# Altium project EEar04.PrjPcb
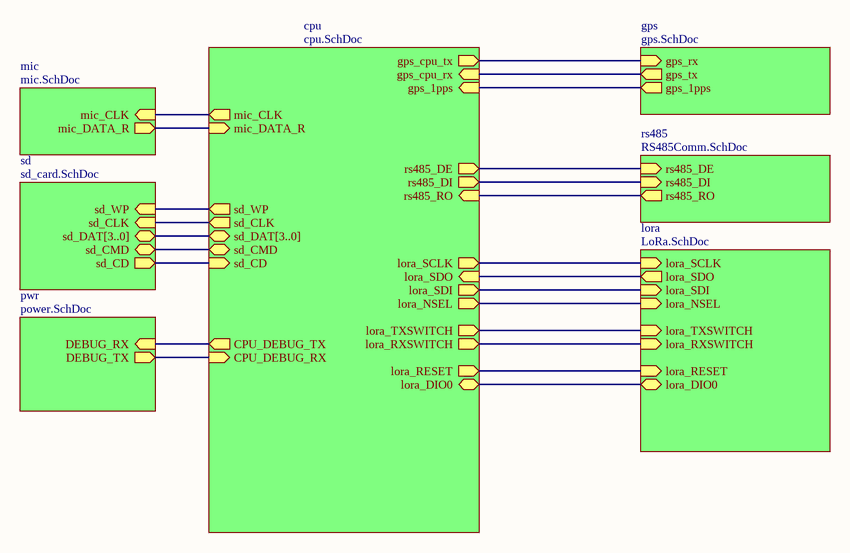
[diagram p0: top.SchDoc]
8 sheets, 130 parts. Net scope: hierarchical (ports join the sheet entries above them; power ports are global).
Board file: EEar04.PcbDoc
Sheets:
  top.SchDoc
    cpu = cpu.SchDoc
    gps = gps.SchDoc
    pwr = power.SchDoc
    mic = mic.SchDoc
    sd = sd_card.SchDoc
    rs485 = RS485Comm.SchDoc
    lora = LoRa.SchDoc

## Sheet top.SchDoc
size A

### Sub-sheets
cpu = cpu.SchDoc: gps_1pps (in), mic_CLK (out), mic_DATA_R (in), sd_WP (out), sd_CLK (out), sd_DAT[3..0] (bidir), sd_CMD (bidir), sd_CD (in), CPU_DEBUG_RX (in), CPU_DEBUG_TX (out), gps_cpu_tx (out), gps_cpu_rx (in), rs485_DI (out), rs485_RO (in), rs485_DE (out), lora_RXSWITCH (out), lora_SDI (out), lora_SCLK (out), lora_SDO (in), lora_NSEL (out), lora_RESET (out), lora_TXSWITCH (out), lora_DIO0 (bidir)
gps = gps.SchDoc: gps_rx (in), gps_tx (out), gps_1pps (out)
lora = LoRa.SchDoc: lora_SDO (out), lora_SCLK (in), lora_NSEL (in), lora_DIO0 (bidir), lora_SDI (in), lora_RESET (in), lora_RXSWITCH (in), lora_TXSWITCH (in)
mic = mic.SchDoc: mic_CLK (in), mic_DATA_R (out)
pwr = power.SchDoc: DEBUG_RX (in), DEBUG_TX (out)
rs485 = RS485Comm.SchDoc: rs485_DE (in), rs485_DI (in), rs485_RO (out)
sd = sd_card.SchDoc: sd_WP (in), sd_CD (out), sd_CMD (bidir), sd_CLK (in), sd_DAT[3..0] (bidir)

### Nets
debug_rx: sheet cpu/CPU_DEBUG_RX, sheet pwr/DEBUG_TX
debug_tx: sheet cpu/CPU_DEBUG_TX, sheet pwr/DEBUG_RX
gps_1pps: sheet cpu/gps_1pps, sheet gps/gps_1pps
gps_cpu_rx: sheet cpu/gps_cpu_rx, sheet gps/gps_tx
gps_cpu_tx: sheet cpu/gps_cpu_tx, sheet gps/gps_rx
lora_DIO0: sheet cpu/lora_DIO0, sheet lora/lora_DIO0
lora_NSEL: sheet cpu/lora_NSEL, sheet lora/lora_NSEL
lora_RESET: sheet cpu/lora_RESET, sheet lora/lora_RESET
lora_RXSWITCH: sheet cpu/lora_RXSWITCH, sheet lora/lora_RXSWITCH
lora_SCLK: sheet cpu/lora_SCLK, sheet lora/lora_SCLK
lora_SDI: sheet cpu/lora_SDI, sheet lora/lora_SDI
lora_SDO: sheet cpu/lora_SDO, sheet lora/lora_SDO
lora_TXSWITCH: sheet cpu/lora_TXSWITCH, sheet lora/lora_TXSWITCH
mic_CLK: sheet cpu/mic_CLK, sheet mic/mic_CLK
mic_DATA_R: sheet cpu/mic_DATA_R, sheet mic/mic_DATA_R
rs485_DE: sheet cpu/rs485_DE, sheet rs485/rs485_DE
rs485_DI: sheet cpu/rs485_DI, sheet rs485/rs485_DI
rs485_RO: sheet cpu/rs485_RO, sheet rs485/rs485_RO
sd_CD: sheet cpu/sd_CD, sheet sd/sd_CD
sd_CLK: sheet cpu/sd_CLK, sheet sd/sd_CLK
sd_CMD: sheet cpu/sd_CMD, sheet sd/sd_CMD
sd_WP: sheet cpu/sd_WP, sheet sd/sd_WP

### Buses and harness runs
bus sheet cpu/sd_DAT[3..0] = sheet sd/sd_DAT[3..0]

## Sheet cpu.SchDoc
size A3
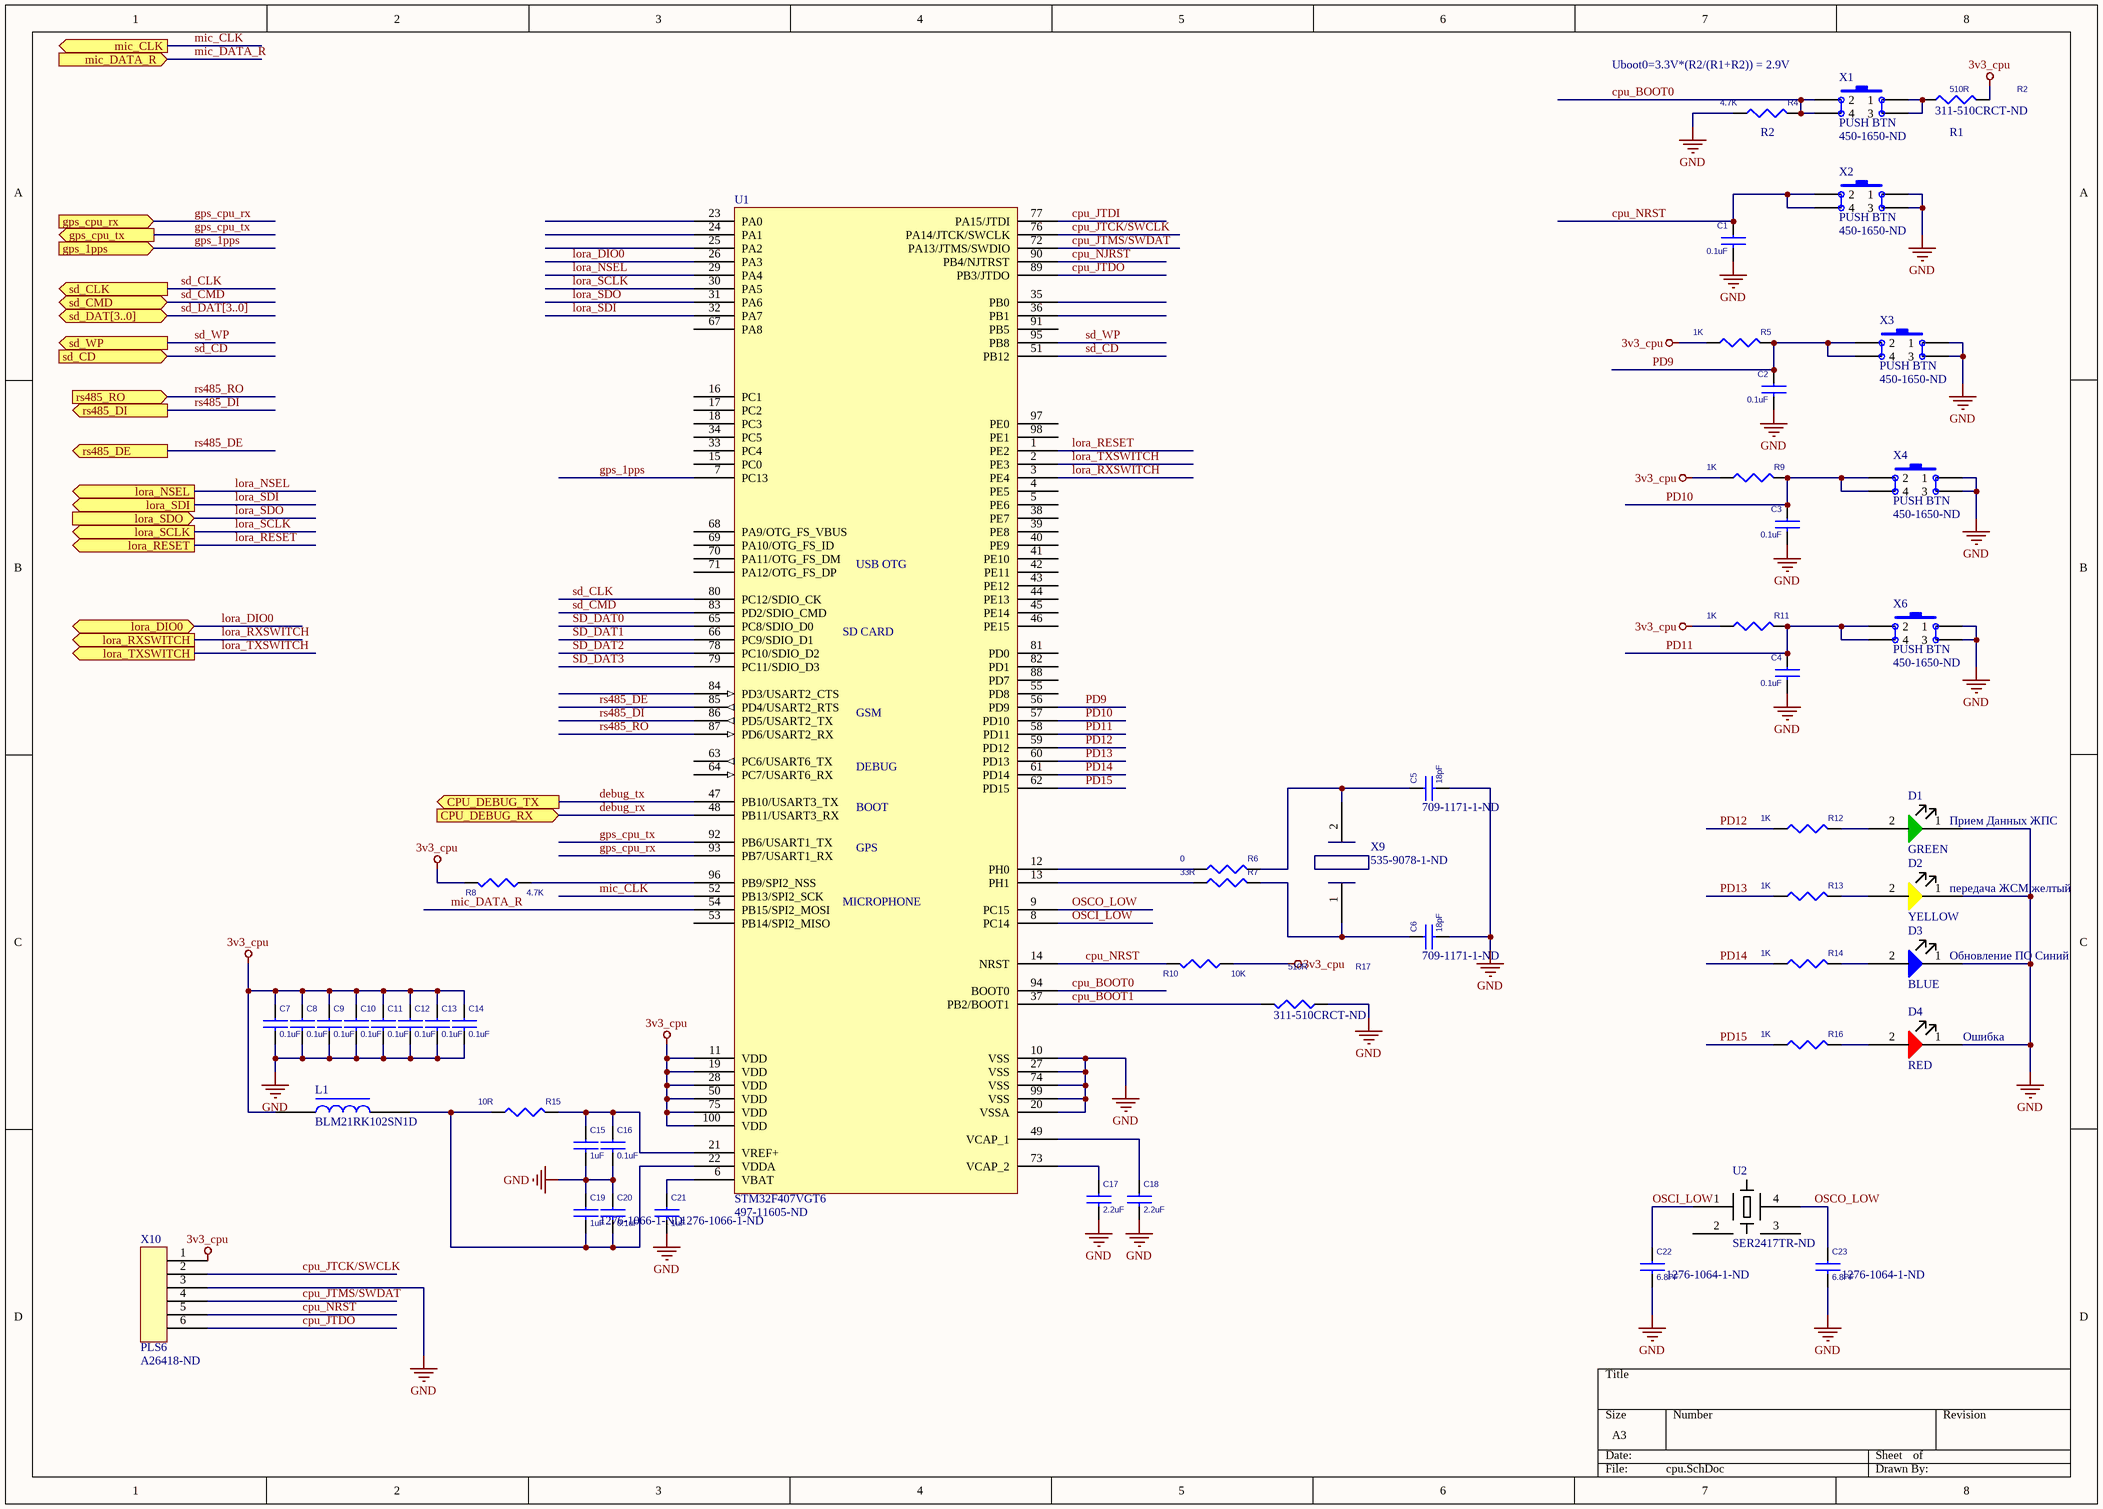
[diagram p1: cpu.SchDoc]

### Parts
C1  0.1uF  [CAPC2012X09M]
C2  0.1uF  [CAPC2012X09M]
C3  0.1uF  [CAPC2012X09M]
C4  0.1uF  [CAPC2012X09M]
C5  18pF  Supplier Part Number 1: 709-1171-1-ND  [CAPC2012X09M]
C6  18pF  Supplier Part Number 1: 709-1171-1-ND  [CAPC2012X09M]
C7  0.1uF  [CAPC2012X09M]
C8  0.1uF  [CAPC2012X09M]
C9  0.1uF  [CAPC2012X09M]
C10  0.1uF  [CAPC2012X09M]
C11  0.1uF  [CAPC2012X09M]
C12  0.1uF  [CAPC2012X09M]
C13  0.1uF  [CAPC2012X09M]
C14  0.1uF  [CAPC2012X09M]
C15  1uF  [CAPC2012X09M]
C16  0.1uF  [CAPC2012X09M]
C17  2.2uF  [CAPC2012X09M]
C18  2.2uF  [CAPC2012X09M]
C19  1uF  Supplier Part Number 1: 1276-1066-1-ND  [CAPC2012X09M]
C20  0.1uF  [CAPC2012X09M]
C21  1uF  Supplier Part Number 1: 1276-1066-1-ND  [CAPC2012X09M]
C22  6.8PF  Supplier Part Number 1: 1276-1064-1-ND  [CAPC2012X09M]
C23  6.8PF  Supplier Part Number 1: 1276-1064-1-ND  [CAPC2012X09M]
D1  GREEN  [DIOC2012X11N]
D2  YELLOW  [DIOC2012X11N]
D3  BLUE  [DIOC2012X11N]
D4  RED  [DIOC2012X11N]
L1  BLM21RK102SN1D  [DIOC2012X11N]
R2  510R  Supplier Part Number 1: 311-510CRCT-ND  [RESC2013X06M]
R4  4.7K  [RESC2013X06M]
R5  1K  [RESC2013X06M]
R6  0  [RESC2013X06M]
R7  33R  [RESC2013X06M]
R8  4.7K  [RESC2013X06M]
R9  1K  [RESC2013X06M]
R10  10K  [RESC2013X06M]
R11  1K  [RESC2013X06M]
R12  1K  [RESC2013X06M]
R13  1K  [RESC2013X06M]
R14  1K  [RESC2013X06M]
R15  10R  [RESC2013X06M]
R16  1K  [RESC2013X06M]
R17  510R  Supplier Part Number 1: 311-510CRCT-ND  [RESC2013X06M]
U1  STM32F407VGT6  Supplier Part Number 1: 497-11605-ND  [TSQFP50P1600X1600X160-100M]
U2  Supplier Part Number 1: SER2417TR-ND  [SOJ550P380X254-4M]  (hidden comment: 32.768KHZ)
X1  PUSH BTN  Supplier Part Number 1: 450-1650-ND  [PUSHBTN]
X2  PUSH BTN  Supplier Part Number 1: 450-1650-ND  [PUSHBTN]
X3  PUSH BTN  Supplier Part Number 1: 450-1650-ND  [PUSHBTN]
X4  PUSH BTN  Supplier Part Number 1: 450-1650-ND  [PUSHBTN]
X6  PUSH BTN  Supplier Part Number 1: 450-1650-ND  [PUSHBTN]
X9  Supplier Part Number 1: 535-9078-1-ND  [SODFL1270X420-2L]  (hidden comment: 25.000Mhz)
X10  PLS6  Supplier Part Number 1: A26418-ND  [PLS6]

### Ports
CPU_DEBUG_RX (in), CPU_DEBUG_TX (out), gps_1pps (in), gps_cpu_rx (in), gps_cpu_tx (out), lora_DIO0 (bidir), lora_NSEL (out), lora_RESET (out), lora_RXSWITCH (out), lora_SCLK (out), lora_SDI (out), lora_SDO (in), lora_TXSWITCH (out), mic_CLK (out), mic_DATA_R (in), rs485_DE (out), rs485_DI (out), rs485_RO (in), sd_CD (in), sd_CLK (out), sd_CMD (bidir), sd_DAT[3..0] (bidir), sd_WP (out)

### Nets
3v3_cpu: C7.1 C8.1 C9.1 C10.1 C11.1 C12.1 C13.1 C14.1 L1.1 R2.1 R5.1 R8.2 R9.1 R10.1 R11.1 U1.11(VDD) U1.19(VDD) U1.28(VDD) U1.50(VDD) U1.75(VDD) U1.100(VDD) X10.1
GND: C1.2 C2.2 C3.2 C4.2 C5.2 C6.2 C7.2 C8.2 C9.2 C10.2 C11.2 C12.2 C13.2 C14.2 C15.2 C16.2 C17.2 C18.2 C19.1 C20.1 C21.2 C22.2 C23.2 D1.1(C) D2.1(C) D3.1(C) D4.1(C) R4.1 R17.1 U1.10(VSS) U1.20(VSSA) U1.27(VSS) U1.74(VSS) U1.99(VSS) X2.1 X2.3 X3.1 X3.3 X4.1 X4.3 X6.1 X6.3 X10.3
cpu_BOOT0: R4.2 U1.94(BOOT0) X1.2 X1.4
cpu_BOOT1: R17.2 U1.37(PB2/BOOT1)
cpu_JTCK/SWCLK: U1.76(PA14/JTCK/SWCLK) X10.2
cpu_JTDI: U1.77(PA15/JTDI)
cpu_JTDO: U1.89(PB3/JTDO) X10.6
cpu_JTMS/SWDAT: U1.72(PA13/JTMS/SWDIO) X10.4
cpu_NJRST: U1.90(PB4/NJTRST)
cpu_NRST: C1.1 R10.2 U1.14(NRST) X2.2 X2.4 X10.5
debug_rx: U1.48(PB11/USART3_RX) ; port CPU_DEBUG_RX
debug_tx: U1.47(PB10/USART3_TX) ; port CPU_DEBUG_TX
gps_1pps: U1.7(PC13) ; port gps_1pps
gps_cpu_rx: U1.93(PB7/USART1_RX) ; port gps_cpu_rx
gps_cpu_tx: U1.92(PB6/USART1_TX) ; port gps_cpu_tx
lora_DIO0: U1.26(PA3) ; port lora_DIO0
lora_NSEL: U1.29(PA4) ; port lora_NSEL
lora_RESET: U1.1(PE2) ; port lora_RESET
lora_RXSWITCH: U1.3(PE4) ; port lora_RXSWITCH
lora_SCLK: U1.30(PA5) ; port lora_SCLK
lora_SDI: U1.32(PA7) ; port lora_SDI
lora_SDO: U1.31(PA6) ; port lora_SDO
lora_TXSWITCH: U1.2(PE3) ; port lora_TXSWITCH
mic_CLK: U1.52(PB13/SPI2_SCK) ; port mic_CLK
mic_DATA_R: U1.54(PB15/SPI2_MOSI) ; port mic_DATA_R
OSCI_LOW: C22.1 U1.8(PC14) U2.1(OSC1)
OSCO_LOW: C23.1 U1.9(PC15) U2.4(OSC2)
PD9: C2.1 R5.2 U1.56(PD9) X3.2 X3.4
PD10: C3.1 R9.2 U1.57(PD10) X4.2 X4.4
PD11: C4.1 R11.2 U1.58(PD11) X6.2 X6.4
PD12: R12.1 U1.59(PD12)
PD13: R13.1 U1.60(PD13)
PD14: R14.1 U1.61(PD14)
PD15: R16.1 U1.62(PD15)
rs485_DE: U1.85(PD4/USART2_RTS) ; port rs485_DE
rs485_DI: U1.86(PD5/USART2_TX) ; port rs485_DI
rs485_RO: U1.87(PD6/USART2_RX) ; port rs485_RO
sd_CD: U1.51(PB12) ; port sd_CD
sd_CLK: U1.80(PC12/SDIO_CK) ; port sd_CLK
sd_CMD: U1.83(PD2/SDIO_CMD) ; port sd_CMD
SD_DAT0: U1.65(PC8/SDIO_D0)
SD_DAT1: U1.66(PC9/SDIO_D1)
SD_DAT2: U1.78(PC10/SDIO_D2)
SD_DAT3: U1.79(PC11/SDIO_D3)
sd_WP: U1.95(PB8) ; port sd_WP
NetC5_1: C5.1 R6.2 X9.2
NetC6_1: C6.1 R7.2 X9.1
NetC15_1: C15.1 C16.1 R15.2 U1.21(VREF+)
NetC17_1: C17.1 U1.73(VCAP_2)
NetC18_1: C18.1 U1.49(VCAP_1)
NetC19_2: C19.2 C20.2 L1.2 R15.1 U1.22(VDDA)
NetC21_1: C21.1 U1.6(VBAT)
NetD1_2: D1.2(A) R12.2
NetD2_2: D2.2(A) R13.2
NetD3_2: D3.2(A) R14.2
NetD4_2: D4.2(A) R16.2
NetR2_2: R2.2 X1.1 X1.3
NetR6_1: R6.1 U1.12(PH0)
NetR7_1: R7.1 U1.13(PH1)
NetR8_1: R8.1 U1.96(PB9/SPI2_NSS)

Not connected (* = marked no-connect by the designer): U1 4(PE5) 5(PE6) 15(PC0) 16(PC1) 17(PC2) 18(PC3) 23(PA0) 24(PA1) 25(PA2) 33(PC4) 34(PC5) 35(PB0) 36(PB1) 38(PE7) 39(PE8) 40(PE9) 41(PE10) 42(PE11) 43(PE12) 44(PE13) 45(PE14) 46(PE15) 53(PB14/SPI2_MISO) 55(PD8) 63(PC6/USART6_TX) 64(PC7/USART6_RX) 67(PA8) 68(PA9/OTG_FS_VBUS) 69(PA10/OTG_FS_ID) 70(PA11/OTG_FS_DM) 71(PA12/OTG_FS_DP) 81(PD0) 82(PD1) 84(PD3/USART2_CTS) 88(PD7) 91(PB5) 97(PE0) 98(PE1); U2 2(NC) 3(NC)

### Buses and harness runs
bus sd_DAT[3..0] = port sd_DAT[3..0]

### Notes on the sheet
- Uboot0=3.3V*(R2/(R1+R2)) = 2.9V
- (near R4) R2
- (near R2) R1
- (near D1) Прием Данных ЖПС
- (near D2) передача ЖСМ желтый
- (near D3) Обновление ПО Синий
- (near D4) Ошибка
- (in symbol STM32F407VGT6) USB OTG; SD CARD; GSM; DEBUG; BOOT; GPS; MICROPHONE

### Library data of the parts
C1-C4 C7-C14 C16 C20 = CAP_SMD_0.1UF_10%: CAP CER 0.1UF 25V 10% X7R 0805; Value: 0.1uF; Supplier 1: Digi-Key; Supplier Part Number 1: 399-1168-6-ND
C5 C6 = CAP_SMD_18PF_5%: CAP CER 27PF 200V 5% NP0 0805; Supplier 1: Digi-Key
C15 C19 C21 = CAP_SMD_1uF_10%: MLCC; 1uF; 25V; X7R; ±10%; SMD; 0805;; Value: 1uF; Supplier 1: Digi-Key
  C15: Supplier Part Number 1: 1276-1066-1-ND
C17 C18 = CAP_SMD_2.2uF_10%: CAP CER 2.2UF 16V 10% X5R 0805; Value: 2.2uF; Supplier 1: Digi-Key; Supplier Part Number 1: 587-1293-1-ND
C22 C23 = CAP_SMD_6.8PF_5%: CAP MLCC 6.8PF 50V 5% NP0 0805; Value: 6.8pF; Supplier 1: Digi-Key
D1 = LED_GREEN: Supplier 1: Digi-Key; Supplier Part Number 1: 160-1179-2-ND
D2 = LED_YELLOW: Supplier 1: Digi-Key; Supplier Part Number 1: 160-1428-1-ND
D3 = LED_BLUE: Supplier 1: Digi-Key; Supplier Part Number 1: 160-1579-1-ND
D4 = LED_RED: Supplier 1: Digi-Key; Supplier Part Number 1: 160-1176-1-ND
R2 R17 = RES_SMD_510_5%: RES - 510 OHM, 5%, 1/8W, 0805 SMD; Supplier 1: Digi-Key
R4 R8 = RES_SMD_4.7K_1%: RES 4.7K OHM 1/8W 1% 0805 SMD; Supplier 1: Digi-Key; Supplier Part Number 1: RMCF0805FT4K70CT-ND
R5 R9 R11-R14 R16 = RES_SMD_1K_5%: RES - 1K OHM, 5%, 1/8W, 0805 SMD; Supplier 1: Digi-Key; Supplier Part Number 1: P1.0KADKR-ND
R6 = RES_SMD_0: RES 0.0 OHM 1/8W JUMP 0805 SMD; Supplier 1: Digi-Key; Supplier Part Number 1: P0.0ATR-ND
R7 = RES_SMD_33R_5%: RES - 33 OHM, 5%, 1/8W, 0805 SMD; Supplier 1: Digi-Key; Supplier Part Number 1: 311-33ARCT-ND
R10 = RES_SMD_10K_5%: RES 10K OHM 1/8W 5% 0805 SMD; Supplier 1: Digi-Key; Supplier Part Number 1: 311-10KARCT-ND
R15 = RES_SMD_10R_5%: RES 10 OHM 1/8W 1% 0805 SMD; Supplier 1: Digi-Key; Supplier Part Number 1: P10.0CCT-ND
U2 = MC-306: Supplier 1: Digi-Key
X1-X4 X6 = SW1: Supplier 1: Digi-Key
X9 = OSC25M: Supplier 1: Digi-Key
L1 = BLM21RK102SN1D: Supplier 1: Digi-Key; Supplier Part Number 1: 490-9711-1-ND
U1 = STM32F407VGT6: Supplier 1: Digi-Key
X10 = PLS6: Supplier 1: Digi-Key

## Sheet gps.SchDoc
size A
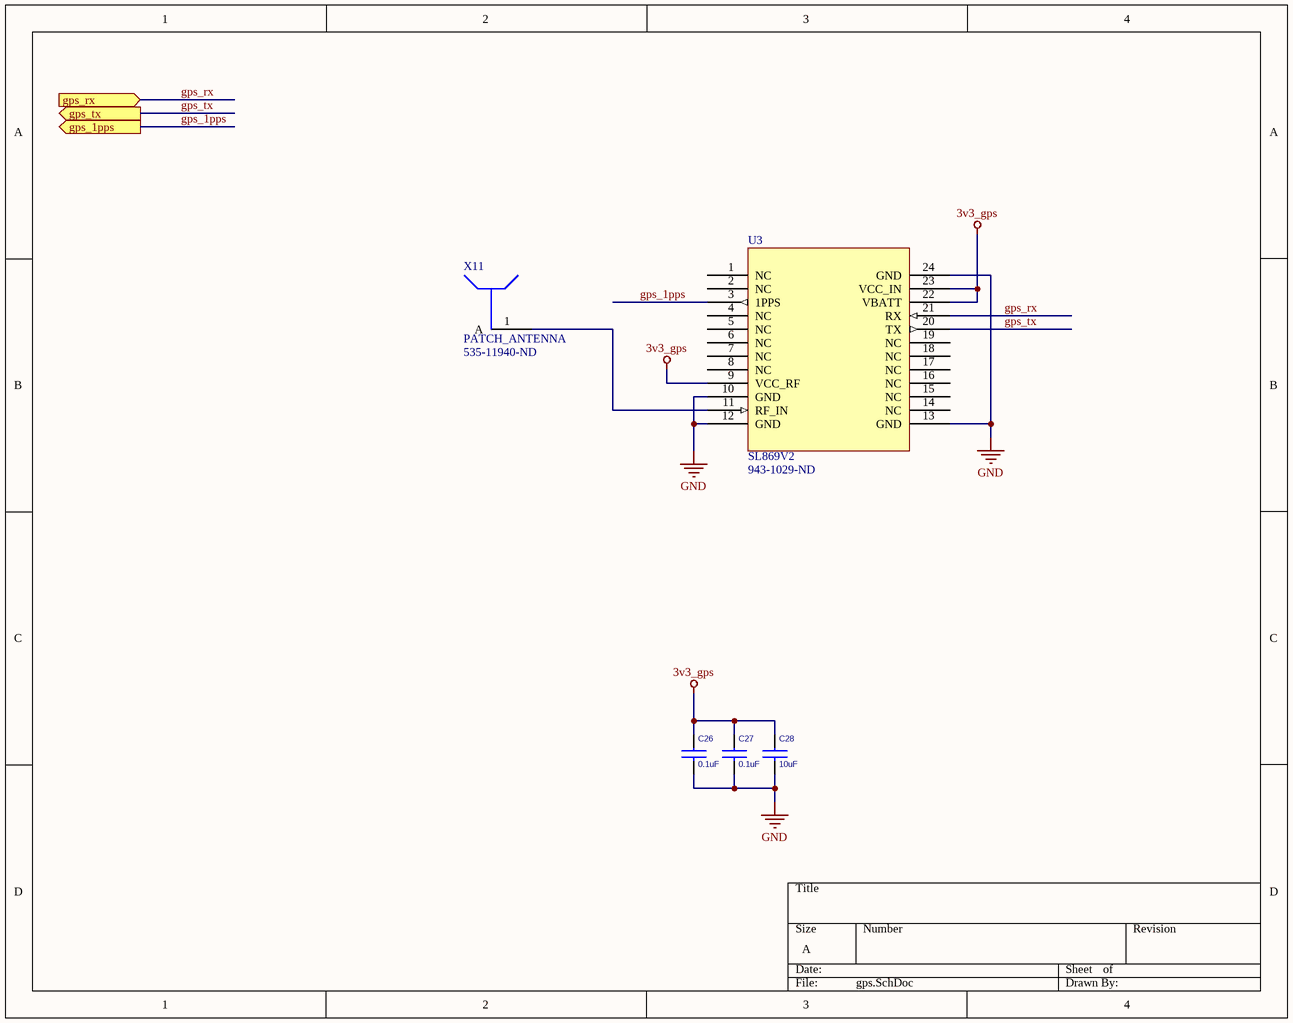
[diagram p2: gps.SchDoc]

### Parts
C26  0.1uF  [CAPC2012X09M]
C27  0.1uF  [CAPC2012X09M]
C28  10uF  [CAPC2012X09M]
U3  SL869V2  Supplier Part Number 1: 943-1029-ND  [SL869V2_FOOT]
X11  PATCH_ANTENNA  Supplier Part Number 1: 535-11940-ND  [PATCH_ANTENNA]

### Ports
gps_1pps (out), gps_rx (in), gps_tx (out)

### Nets
3v3_gps: C26.1 C27.1 C28.1 U3.9(VCC_RF) U3.22(VBATT) U3.23(VCC_IN)  [project net 3v3_cpu]
GND: C26.2 C27.2 C28.2 U3.10(GND) U3.12(GND) U3.13(GND) U3.24(GND)
gps_1pps: U3.3(1PPS) ; port gps_1pps
gps_rx: U3.21(RX) ; port gps_rx  [project net gps_cpu_tx]
gps_tx: U3.20(TX) ; port gps_tx  [project net gps_cpu_rx]
NetU3_11: U3.11(RF_IN) X11.1(A)

Not connected (* = marked no-connect by the designer): U3 1(NC) 2(NC) 4(NC) 5(NC) 6(NC) 7(NC) 8(NC) 14(NC) 15(NC) 16(NC) 17(NC) 18(NC) 19(NC)

### Library data of the parts
C26 C27 = CAP_SMD_0.1UF_10%: CAP CER 0.1UF 25V 10% X7R 0805; Value: 0.1uF; Supplier 1: Digi-Key; Supplier Part Number 1: 399-1168-6-ND
C28 = CAP_SMD_10UF_20%: CAP CER 10UF 16V 20% X5R 0805; Value: 10uF; Supplier 1: Digi-Key; Supplier Part Number 1: 399-8013-1-ND
U3 = SL869V2: Supplier 1: Digi-Key
X11 = PATCH_ANTENNA: Supplier 1: Digi-Key

## Sheet power.SchDoc
size A4
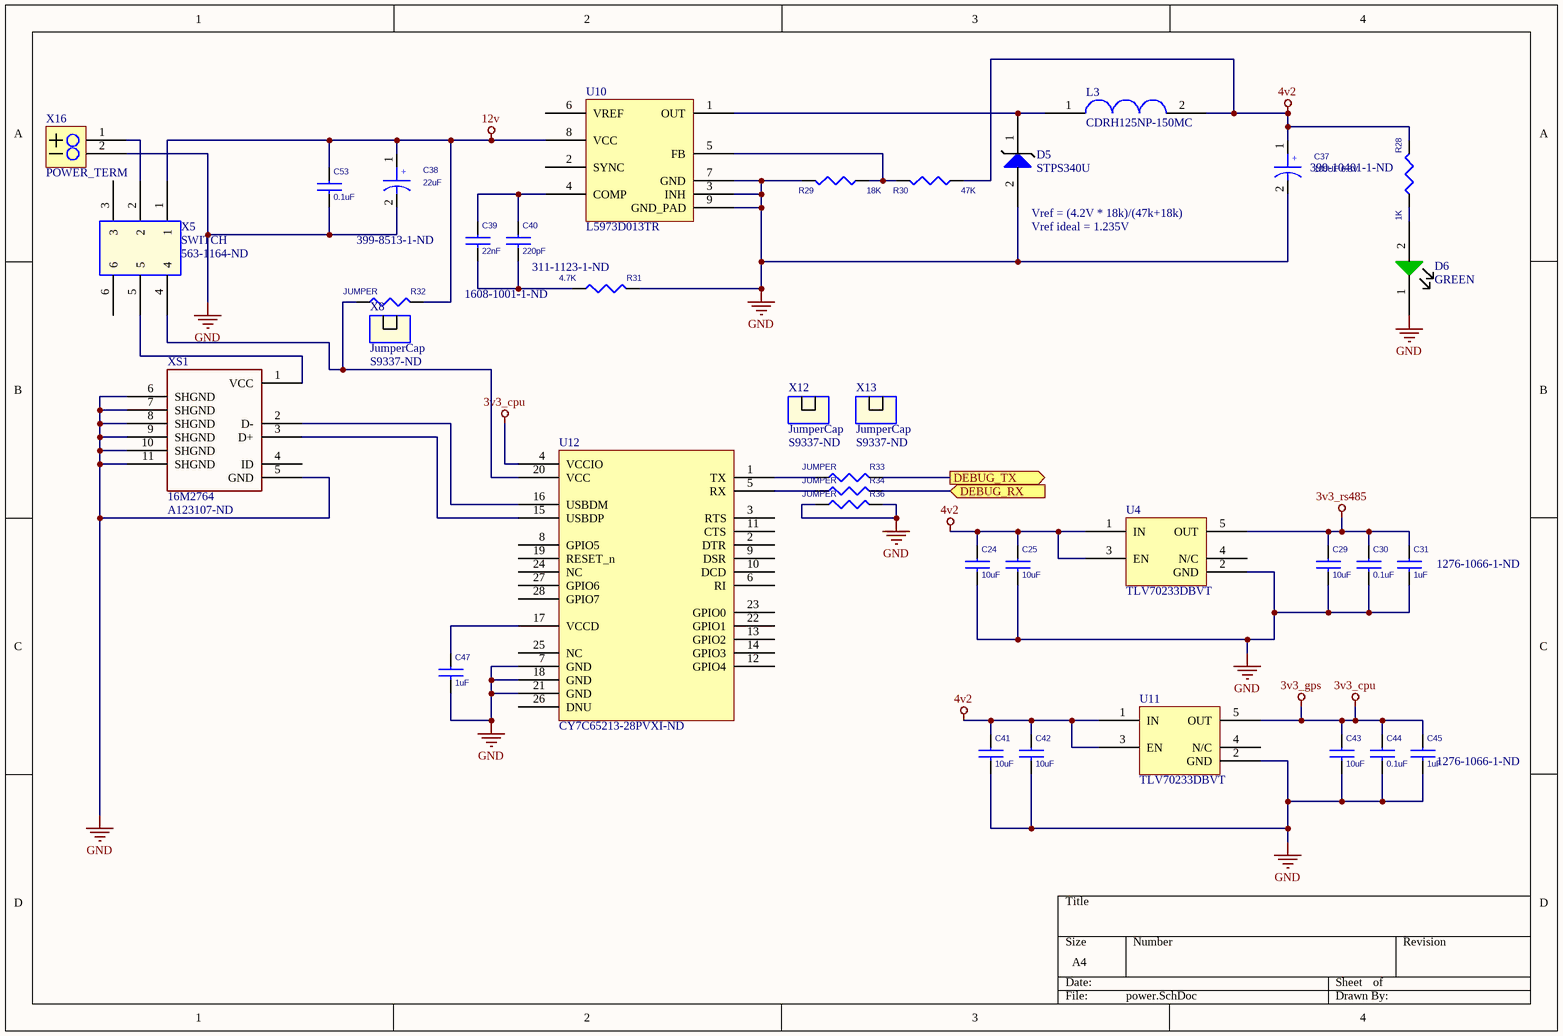
[diagram p3: power.SchDoc]

### Parts
C24  10uF  [CAPC2012X09M]
C25  10uF  [CAPC2012X09M]
C29  10uF  [CAPC2012X09M]
C30  0.1uF  [CAPC2012X09M]
C31  1uF  Supplier Part Number 1: 1276-1066-1-ND  [CAPC2012X09M]
C37  100UF 6.3V  Supplier Part Number 1: 399-10401-1-ND  [CAPMP6133X31N]
C38  22uF  Supplier Part Number 1: 399-8513-1-ND  [CAPMP7143X31N]
C39  22nF  Supplier Part Number 1: 1608-1001-1-ND  [CAPC2012X09M]
C40  220pF  Supplier Part Number 1: 311-1123-1-ND  [CAPC2012X09M]
C41  10uF  [CAPC2012X09M]
C42  10uF  [CAPC2012X09M]
C43  10uF  [CAPC2012X09M]
C44  0.1uF  [CAPC2012X09M]
C45  1uF  Supplier Part Number 1: 1276-1066-1-ND  [CAPC2012X09M]
C47  1uF  [CAPC2012X09M]
C53  0.1uF  [CAPC2012X09M]
D5  STPS340U  [SODFL535X265-2N]
D6  GREEN  [DIOC2012X11N]
L3  CDRH125NP-150MC  [INDP123123X40N_SUMIDA]
R28  1K  [RESC2013X06M]
R29  18K  [RESC2013X06M]
R30  47K  [RESC2013X06M]
R31  4.7K  [RESC2013X06M]
R32  JUMPER  [RESC2013X06M_CMEASURE]
R33  JUMPER  [RESC2013X06M_CMEASURE]
R34  JUMPER  [RESC2013X06M_CMEASURE]
R36  JUMPER  [RESC2013X06M_CMEASURE]
U4  TLV70233DBVT  [SOT95P280X145-5M]
U10  L5973D013TR  [SOIC127P600X175_HS-9N]
U11  TLV70233DBVT  [SOT95P280X145-5M]
U12  Supplier Part Number 1: CY7C65213-28PVXI-ND  [SOP65P780X200-28M]  (hidden comment: CY7C65213)
X5  SWITCH  Supplier Part Number 1: 563-1164-ND  [SWITCH]
X8  JumperCap  Supplier Part Number 1: S9337-ND
X12  JumperCap  Supplier Part Number 1: S9337-ND
X13  JumperCap  Supplier Part Number 1: S9337-ND
X16  POWER_TERM  [PH5]
XS1  16M2764  Supplier Part Number 1: A123107-ND  [USB_MINI_16M2764]

### Ports
DEBUG_RX (in), DEBUG_TX (out)

### Nets
3v3_cpu: C43.1 C44.1 C45.1 U11.5(OUT) U12.4(VCCIO)  [also labelled 3v3_gps]
3v3_rs485: C29.1 C30.1 C31.1 U4.5(OUT)
4v2: C24.1 C25.1 C37.1 C41.1 C42.1 L3.2 R28.2 R30.1 U4.1(IN) U4.3(EN) U11.1(IN) U11.3(EN)
12v: C38.1 C53.1 R32.2 U10.8(VCC) X5.1
GND: C24.2 C25.2 C29.2 C30.2 C31.2 C37.2 C38.2 C41.2 C42.2 C43.2 C44.2 C45.2 C47.2 C53.2 D5.2(A) D6.1(C) R29.2 R31.2 R36.1 R36.2 U4.2(GND) U10.3(INH) U10.7(GND) U10.9(GND_PAD) U11.2(GND) U12.7(GND) U12.18(GND) U12.21(GND) X16.2 XS1.5(GND) XS1.6(SHGND) XS1.7(SHGND) XS1.8(SHGND) XS1.9(SHGND) XS1.10(SHGND) XS1.11(SHGND)
debug_rx: R33.2 ; port DEBUG_TX
debug_tx: R34.2 ; port DEBUG_RX
NetC39_1: C39.1 C40.1 U10.4(COMP)
NetC39_2: C39.2 C40.2 R31.1
NetC47_1: C47.1 U12.17(VCCD)
NetD5_1: D5.1(C) L3.1 U10.1(OUT)
NetD6_2: D6.2(A) R28.1
NetR29_1: R29.1 R30.2 U10.5(FB)
NetR32_1: R32.1 U12.20(VCC) X5.4
NetR33_1: R33.1 U12.1(TX)
NetR34_1: R34.1 U12.5(RX)
NetU12_15: U12.15(USBDP) XS1.3(D+)
NetU12_16: U12.16(USBDM) XS1.2(D-)
NetX5_2: X5.2 X16.1
NetX5_5: X5.5 XS1.1(VCC)

Not connected (* = marked no-connect by the designer): U4 4(N/C); U10 2(SYNC) 6(VREF); U11 4(N/C); U12 2(DTR) 3(RTS) 6(RI) 8(GPIO5) 9(DSR) 10(DCD) 11(CTS) 12(GPIO4) 13(GPIO2) 14(GPIO3) 19(RESET_n) 22(GPIO1) 23(GPIO0) 24(NC) 25(NC) 26(DNU) 27(GPIO6) 28(GPIO7); X5 3 6; XS1 4(ID)

### Notes on the sheet
- (near D5) Vref = (4.2V * 18k)/(47k+18k)
- Vref ideal = 1.235V
- (in symbol CAP_SMD_22UF_10%) +
- (in symbol CAP_SMD_100UF_10%) +

### Library data of the parts
C24 C25 C29 C41-C43 = CAP_SMD_10UF_20%: CAP CER 10UF 16V 20% X5R 0805; Value: 10uF; Supplier 1: Digi-Key; Supplier Part Number 1: 399-8013-1-ND
C30 C44 C53 = CAP_SMD_0.1UF_10%: CAP CER 0.1UF 25V 10% X7R 0805; Value: 0.1uF; Supplier 1: Digi-Key; Supplier Part Number 1: 399-1168-6-ND
C31 C45 C47 = CAP_SMD_1uF_10%: MLCC; 1uF; 25V; X7R; ±10%; SMD; 0805;; Value: 1uF; Supplier 1: Digi-Key
  C47: Supplier Part Number 1: 1276-1066-1-ND
C37 = CAP_SMD_100UF_10%: CAP 100uF; 6.3V; Case: C; ESR:150mOhm; Supplier 1: Digi-Key
C38 = CAP_SMD_22UF_10%: CAP SMD 35volts 22uF 10% ESR=300mOhms; Supplier 1: Digi-Key
C39 = CAP_SMD_22nF_10%: CAP 22NF 50V 10% X7R 0805; Value: 22nF; Supplier 1: Digi-Key
C40 = CAP_SMD_220pF_10%: CAP 220PF 50V 10%  0805; Value: 220pF; Supplier 1: Digi-Key
D5 = STPS340U: DIODE, ZENER, 20V, 3W; Supplier 1: Digi-Key; Supplier Part Number 1: 497-13432-1-ND
D6 = LED_GREEN: Supplier 1: Digi-Key; Supplier Part Number 1: 160-1179-2-ND
L3 = IND_15uH_3.3A: Supplier 1: Digi-Key; Supplier Part Number 1: 308-1440-1-ND
R28 = RES_SMD_1K_5%: RES - 1K OHM, 5%, 1/8W, 0805 SMD; Supplier 1: Digi-Key; Supplier Part Number 1: P1.0KADKR-ND
R29 = RES_SMD_18K_1%: RES 18K OHM 1/8W 1% 0805 SMD; Supplier 1: Digi-Key; Supplier Part Number 1: P18.0KCCT-ND
R30 = RES_SMD_47K_1%: RES 47K OHM 1/8W 1% 0805; Supplier 1: Digi-Key; Supplier Part Number 1: 1276-5377-2-ND
R31 = RES_SMD_4.7K_1%: RES 4.7K OHM 1/8W 1% 0805 SMD; Supplier 1: Digi-Key; Supplier Part Number 1: RMCF0805FT4K70CT-ND
R32-R34 R36 = RES_SMD_0_CURRENT: RES 0.0 OHM 1/8W JUMP 0805 SMD; Supplier 1: Digi-Key; Supplier Part Number 1: 732-5315-ND
U10 = L5973D013TR: IC REG BUCK ADJ 2.5A SOIC8; Supplier 1: Digi-Key; Supplier Part Number 1: 497-14766-5-ND
X8 X12 X13 = JumperCap: For BOM only; Supplier 1: Digi-Key
XS1 = USB_MINI_16M2764: Supplier 1: Digi-Key
U4 U11 = TLV70233DBVT: Supplier 1: Digi-Key; Supplier Part Number 1: 296-32415-1-ND
U12 = CY7C65213: Supplier 1: Digi-Key
X5 = SWITCH: Supplier 1: Digi-Key
X16 = POWER_TERM: Supplier 1: Digi-Key; Supplier Part Number 1: 609-3936-ND

## Sheet mic.SchDoc
size A4
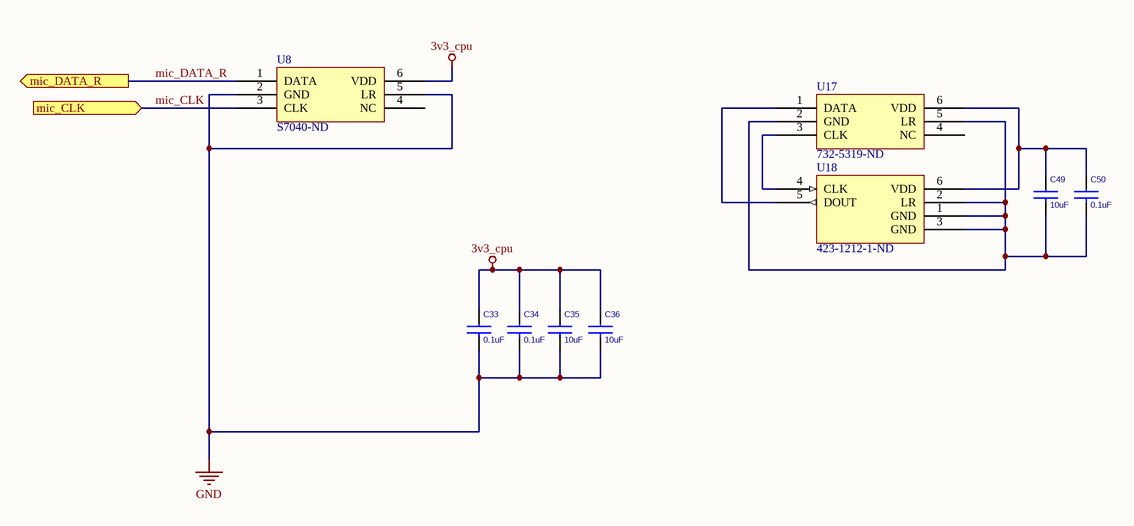
[diagram p4: mic.SchDoc]

### Parts
C33  0.1uF  [CAPC2012X09M]
C34  0.1uF  [CAPC2012X09M]
C35  10uF  [CAPC2012X09M]
C36  10uF  [CAPC2012X09M]
C49  10uF  [CAPC2012X09M]
C50  0.1uF  [CAPC2012X09M]
U8  Supplier Part Number 1: S7040-ND  [STEVAL-MKI129V1]  (hidden comment: STEVAL-MKI129V1-MOUNT-MAMA)
U17  Supplier Part Number 1: 732-5319-ND  [STEVAL-MKI129V1]  (hidden comment: STEVAL-MKI129V1-MOUNT-PAPA)
U18  Supplier Part Number 1: 423-1212-1-ND  [LGA6C165P2X3_376X472X125]  (hidden comment: SPM1437HM4H-B)

### Ports
mic_CLK (in), mic_DATA_R (out)

### Nets
3v3_cpu: C33.1 C34.1 C35.1 C36.1 U8.6(VDD)
GND: C33.2 C34.2 C35.2 C36.2 U8.2(GND) U8.5(LR)
mic_CLK: U8.3(CLK) ; port mic_CLK
mic_DATA_R: U8.1(DATA) ; port mic_DATA_R
NetC49_1: C49.1 C50.1 U17.6(VDD) U18.6(VDD)
NetC49_2: C49.2 C50.2 U17.2(GND) U17.5(LR) U18.1(GND) U18.2(LR) U18.3(GND)
NetU17_1: U17.1(DATA) U18.5(DOUT)
NetU17_3: U17.3(CLK) U18.4(CLK)

Not connected (* = marked no-connect by the designer): U8 4(NC); U17 4(NC)

### Library data of the parts
C33 C34 C50 = CAP_SMD_0.1UF_10%: CAP CER 0.1UF 25V 10% X7R 0805; Value: 0.1uF; Supplier 1: Digi-Key; Supplier Part Number 1: 399-1168-6-ND
C35 C36 C49 = CAP_SMD_10UF_20%: CAP CER 10UF 16V 20% X5R 0805; Value: 10uF; Supplier 1: Digi-Key; Supplier Part Number 1: 399-8013-1-ND
U8 = STEVAL-MKI129V1-MOUNT-MAMA: Supplier 1: Digi-Key
U17 = STEVAL-MKI129V1-MOUNT-PAPA: Supplier 1: Digi-Key
U18 = SPM1437HM4H-B: Supplier 1: Digi-Key

## Sheet sd_card.SchDoc
size A4
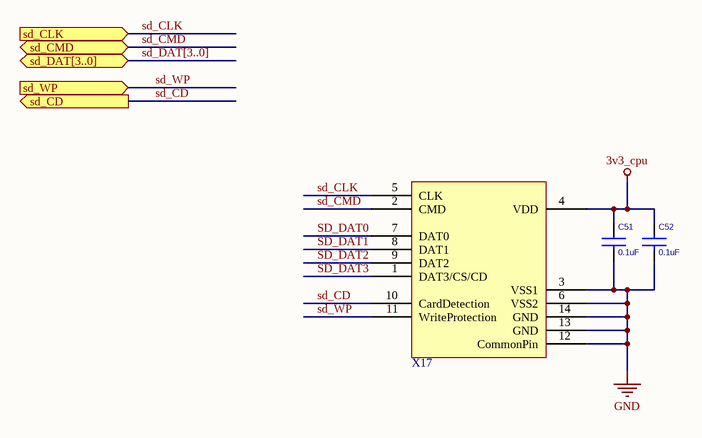
[diagram p5: sd_card.SchDoc]

### Parts
C51  0.1uF  [CAPC2012X09M]
C52  0.1uF  [CAPC2012X09M]
X17  104H-TDA0-R01  [104H-TDA0-R01]  (value not drawn)

### Ports
sd_CD (out), sd_CLK (in), sd_CMD (bidir), sd_DAT[3..0] (bidir), sd_WP (in)

### Nets
3v3_cpu: C51.1 C52.1 X17.4(VDD)
GND: C51.2 C52.2 X17.3(VSS1) X17.6(VSS2) X17.12(CommonPin) X17.13(GND) X17.14(GND)
sd_CD: X17.10(CardDetection) ; port sd_CD
sd_CLK: X17.5(CLK) ; port sd_CLK
sd_CMD: X17.2(CMD) ; port sd_CMD
SD_DAT0: X17.7(DAT0)
SD_DAT1: X17.8(DAT1)
SD_DAT2: X17.9(DAT2)
SD_DAT3: X17.1(DAT3/CS/CD)
sd_WP: X17.11(WriteProtection) ; port sd_WP

### Buses and harness runs
bus sd_DAT[3..0] = port sd_DAT[3..0]

### Library data of the parts
C51 C52 = CAP_SMD_0.1UF_10%: CAP CER 0.1UF 25V 10% X7R 0805; Value: 0.1uF; Supplier 1: Digi-Key; Supplier Part Number 1: 399-1168-6-ND
X17 = 104H-TDA0-R01: Supplier1: www.voelkner.de; Supplier Part Number 1: Y762531

## Sheet RS485Comm.SchDoc
size A3
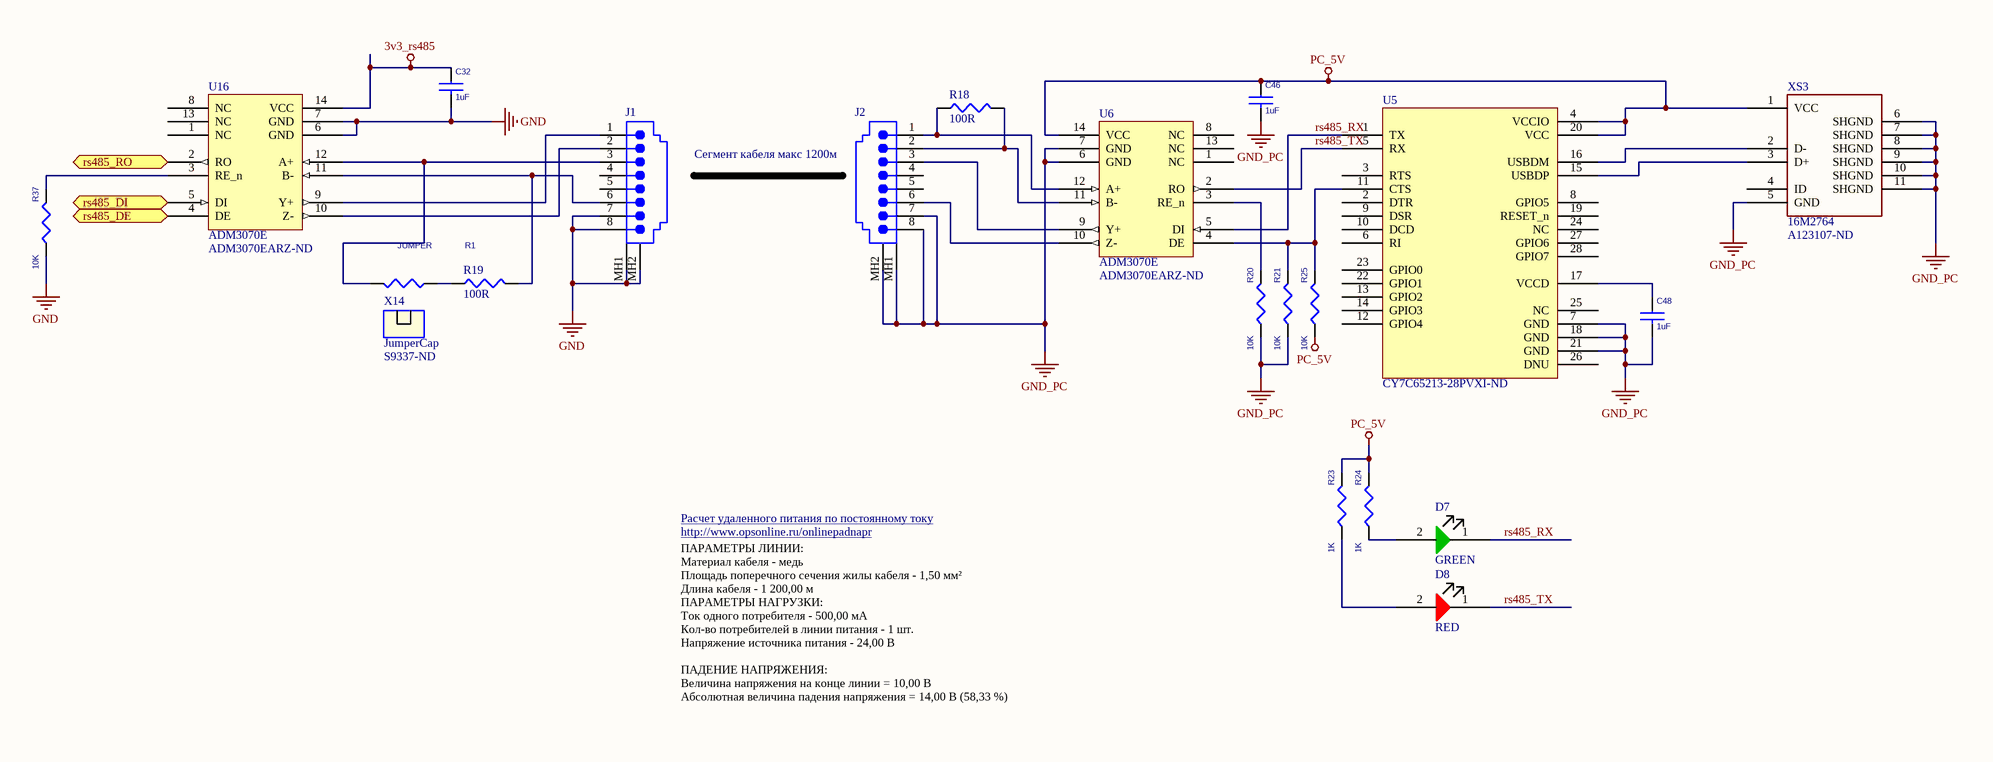
[diagram p6: RS485Comm.SchDoc]

### Parts
C32  1uF  [CAPC2012X09M]
C46  1uF  [CAPC2012X09M]
C48  1uF  [CAPC2012X09M]
D7  GREEN  [DIOC2012X11N]
D8  RED  [DIOC2012X11N]
J1  RJ-45  [RJ-45_PCB]  (value not drawn)
J2  RJ-45_1  [RJ-45_PCB]  (value not drawn)
R1  JUMPER  [RESC2013X06M_CMEASURE]
R18  100R  [RESC2013X06M]
R19  100R  [RESC2013X06M]
R20  10K  [RESC2013X06M]
R21  10K  [RESC2013X06M]
R23  1K  [RESC2013X06M]
R24  1K  [RESC2013X06M]
R25  10K  [RESC2013X06M]
R37  10K  [RESC2013X06M]
U5  Supplier Part Number 1: CY7C65213-28PVXI-ND  [SOP65P780X200-28M]  (hidden comment: CY7C65213)
U6  ADM3070E  Supplier Part Number 1: ADM3070EARZ-ND  [SOIC127P600X175-14N]
U16  ADM3070E  Supplier Part Number 1: ADM3070EARZ-ND  [SOIC127P600X175-14N]
X14  JumperCap  Supplier Part Number 1: S9337-ND
XS3  16M2764  Supplier Part Number 1: A123107-ND  [USB_MINI_16M2764]

### Ports
rs485_DE (in), rs485_DI (in), rs485_RO (out)

### Nets
3v3_rs485: C32.1 U16.14(VCC)
GND: C32.2 J1.7 J1.8 J1.MH1(Shield) J1.MH2(Shield) R37.1 U16.6(GND) U16.7(GND)
GND_PC: C46.2 C48.2 J2.7 J2.8 J2.MH1(Shield) J2.MH2(Shield) R20.1 R21.1 U5.7(GND) U5.18(GND) U5.21(GND) U6.6(GND) U6.7(GND) XS3.5(GND) XS3.6(SHGND) XS3.7(SHGND) XS3.8(SHGND) XS3.9(SHGND) XS3.10(SHGND) XS3.11(SHGND)
PC_5V: C46.1 R23.2 R24.2 R25.1 U5.4(VCCIO) U5.20(VCC) U6.14(VCC) XS3.1(VCC)
rs485_DE: U16.4(DE) ; port rs485_DE
rs485_DI: U16.5(DI) ; port rs485_DI
rs485_RO: U16.2(RO) ; port rs485_RO
rs485_RX: D7.1(C) U5.1(TX) U6.5(DI)
rs485_TX: D8.1(C) U5.5(RX) U6.2(RO)
NetC48_1: C48.1 U5.17(VCCD)
NetD7_2: D7.2(A) R24.1
NetD8_2: D8.2(A) R23.1
NetJ1_1: J1.1 U16.9(Y+)
NetJ1_2: J1.2 U16.10(Z-)
NetJ1_3: J1.3 R1.2 U16.12(A+)
NetJ1_6: J1.6 R19.2 U16.11(B-)
NetJ2_1: J2.1 R18.1 U6.12(A+)
NetJ2_2: J2.2 R18.2 U6.11(B-)
NetJ2_3: J2.3 U6.9(Y+)
NetJ2_6: J2.6 U6.10(Z-)
NetR1_1: R1.1 R19.1
NetR20_2: R20.2 U6.3(RE_n)
NetR21_2: R21.2 R25.2 U5.11(CTS) U6.4(DE)
NetR37_2: R37.2 U16.3(RE_n)
NetU5_15: U5.15(USBDP) XS3.3(D+)
NetU5_16: U5.16(USBDM) XS3.2(D-)

Not connected (* = marked no-connect by the designer): J1 4 5; J2 4 5; U5 2(DTR) 3(RTS) 6(RI) 8(GPIO5) 9(DSR) 10(DCD) 12(GPIO4) 13(GPIO2) 14(GPIO3) 19(RESET_n) 22(GPIO1) 23(GPIO0) 24(NC) 25(NC) 26(DNU) 27(GPIO6) 28(GPIO7); U6 1(NC) 8(NC) 13(NC); U16 1(NC) 8(NC) 13(NC); XS3 4(ID)

### Notes on the sheet
- Сегмент кабеля макс 1200м
- http://www.opsonline.ru/onlinepadnapr
- Расчет удаленного питания по постоянному току
- ПАРАМЕТРЫ ЛИНИИ:
  Материал кабеля - медь
  Площадь поперечного сечения жилы кабеля - 1,50 мм²
  Длина кабеля - 1 200,00 м
  ПАРАМЕТРЫ НАГРУЗКИ:
  Ток одного потребителя - 500,00 мА
  Кол-во потребителей в линии питания - 1 шт.
  Напряжение источника питания - 24,00 В
  ПАДЕНИЕ НАПРЯЖЕНИЯ:
  Величина напряжения на конце линии = 10,00 В
  Абсолютная величина падения напряжения = 14,00 В (58,33 %)

### Library data of the parts
C32 C46 C48 = CAP_SMD_1uF_10%: MLCC; 1uF; 25V; X7R; ±10%; SMD; 0805;; Value: 1uF; Supplier 1: Digi-Key; Supplier Part Number 1: 1276-1066-1-ND
D7 = LED_GREEN: Supplier 1: Digi-Key; Supplier Part Number 1: 160-1179-2-ND
D8 = LED_RED: Supplier 1: Digi-Key; Supplier Part Number 1: 160-1176-1-ND
J1 = RJ-45: Jack Modular Connector 8p8c (RJ45, Ethernet) Vertical Unshielded Cat3; Supplier 1: Digi-Key; Supplier Part Number 1: A31428-ND
J2 = RJ-45_1: Jack Modular Connector 8p8c (RJ45, Ethernet) 90° Angle (Right) Unshielded Cat3; Supplier 1: Digi-Key; Supplier Part Number 1: 609-1046-ND
R1 = RES_SMD_0_CURRENT: RES 0.0 OHM 1/8W JUMP 0805 SMD; Supplier 1: Digi-Key; Supplier Part Number 1: 732-5315-ND
R18 R19 = RES_SMD_100R_1%: RES - 100 OHM, 1%, 1/8W, 0805 SMD; Supplier 1: Digi-Key; Supplier Part Number 1: 311-100CRTR-ND
R20 R21 R25 R37 = RES_SMD_10K_5%: RES 10K OHM 1/8W 5% 0805 SMD; Supplier 1: Digi-Key; Supplier Part Number 1: 311-10KARCT-ND
R23 R24 = RES_SMD_1K_5%: RES - 1K OHM, 5%, 1/8W, 0805 SMD; Supplier 1: Digi-Key; Supplier Part Number 1: P1.0KADKR-ND
X14 = JumperCap: For BOM only; Supplier 1: Digi-Key
XS3 = USB_MINI_16M2764: Supplier 1: Digi-Key
U5 = CY7C65213: Supplier 1: Digi-Key
U6 U16 = ADM3070E: Supplier 1: Digi-Key

## Sheet LoRa.SchDoc
size A4
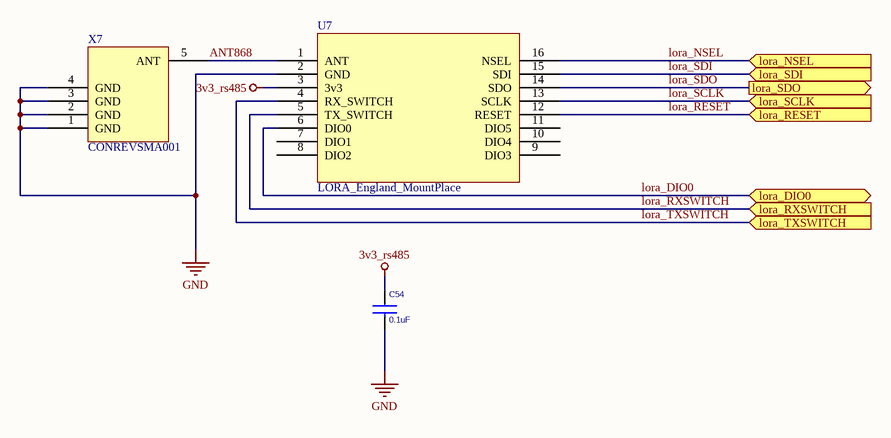
[diagram p7: LoRa.SchDoc]

### Parts
C54  0.1uF  [CAPC2012X09M]
U7  LORA_England_MountPlace  [DIP16]
X7  CONREVSMA001  [SMA6252A2-3GT50G-50]

### Ports
lora_DIO0 (bidir), lora_NSEL (in), lora_RESET (in), lora_RXSWITCH (in), lora_SCLK (in), lora_SDI (in), lora_SDO (out), lora_TXSWITCH (in)

### Nets
3v3_rs485: C54.1 U7.3(3v3)
GND: C54.2 U7.2(GND) X7.1(GND) X7.2(GND) X7.3(GND) X7.4(GND)
ANT868: U7.1(ANT) X7.5(ANT)
lora_DIO0: U7.6(DIO0) ; port lora_DIO0
lora_NSEL: U7.16(NSEL) ; port lora_NSEL
lora_RESET: U7.12(RESET) ; port lora_RESET
lora_RXSWITCH: U7.5(TX_SWITCH) ; port lora_RXSWITCH
lora_SCLK: U7.13(SCLK) ; port lora_SCLK
lora_SDI: U7.15(SDI) ; port lora_SDI
lora_SDO: U7.14(SDO) ; port lora_SDO
lora_TXSWITCH: U7.4(RX_SWITCH) ; port lora_TXSWITCH

Not connected (* = marked no-connect by the designer): U7 7(DIO1) 8(DIO2) 9(DIO3) 10(DIO4) 11(DIO5)

### Library data of the parts
C54 = CAP_SMD_0.1UF_10%: CAP CER 0.1UF 25V 10% X7R 0805; Value: 0.1uF; Supplier 1: Digi-Key; Supplier Part Number 1: 399-1168-6-ND
U7 = LORA_MODULE_E: Supplier 1: Digi-key; Supplier Part Number 1: S7050-ND
X7 = SMA_CONN: Supplier 1: Digi-key; Supplier Part Number 1: CONREVSMA001-ND

## Nets that join several sheets
3v3_cpu: cpu (22 pins), gps (6 pins), power (5 pins), mic (5 pins), sd_card (C51.1 C52.1 X17.4)
3v3_rs485: power (C29.1 C30.1 C31.1 U4.5), RS485Comm (C32.1 U16.14), LoRa (C54.1 U7.3)
GND: cpu (43 pins), gps (7 pins), power (36 pins), mic (6 pins), sd_card (7 pins), RS485Comm (8 pins), LoRa (6 pins)
debug_rx: cpu (U1.48), power (R33.2)
debug_tx: cpu (U1.47), power (R34.2)
gps_1pps: cpu (U1.7), gps (U3.3)
gps_cpu_rx: cpu (U1.93), gps (U3.20)
gps_cpu_tx: cpu (U1.92), gps (U3.21)
lora_DIO0: cpu (U1.26), LoRa (U7.6)
lora_NSEL: cpu (U1.29), LoRa (U7.16)
lora_RESET: cpu (U1.1), LoRa (U7.12)
lora_RXSWITCH: cpu (U1.3), LoRa (U7.5)
lora_SCLK: cpu (U1.30), LoRa (U7.13)
lora_SDI: cpu (U1.32), LoRa (U7.15)
lora_SDO: cpu (U1.31), LoRa (U7.14)
lora_TXSWITCH: cpu (U1.2), LoRa (U7.4)
mic_CLK: cpu (U1.52), mic (U8.3)
mic_DATA_R: cpu (U1.54), mic (U8.1)
rs485_DE: cpu (U1.85), RS485Comm (U16.4)
rs485_DI: cpu (U1.86), RS485Comm (U16.5)
rs485_RO: cpu (U1.87), RS485Comm (U16.2)
sd_CD: cpu (U1.51), sd_card (X17.10)
sd_CLK: cpu (U1.80), sd_card (X17.5)
sd_CMD: cpu (U1.83), sd_card (X17.2)
SD_DAT0: cpu (U1.65), sd_card (X17.7)
SD_DAT1: cpu (U1.66), sd_card (X17.8)
SD_DAT2: cpu (U1.78), sd_card (X17.9)
SD_DAT3: cpu (U1.79), sd_card (X17.1)
sd_WP: cpu (U1.95), sd_card (X17.11)

## Assembly variants
BASECONFIG: not fitted R21 R22 U7 U8 U9 U13 U18 X5 X7 X17 XS2